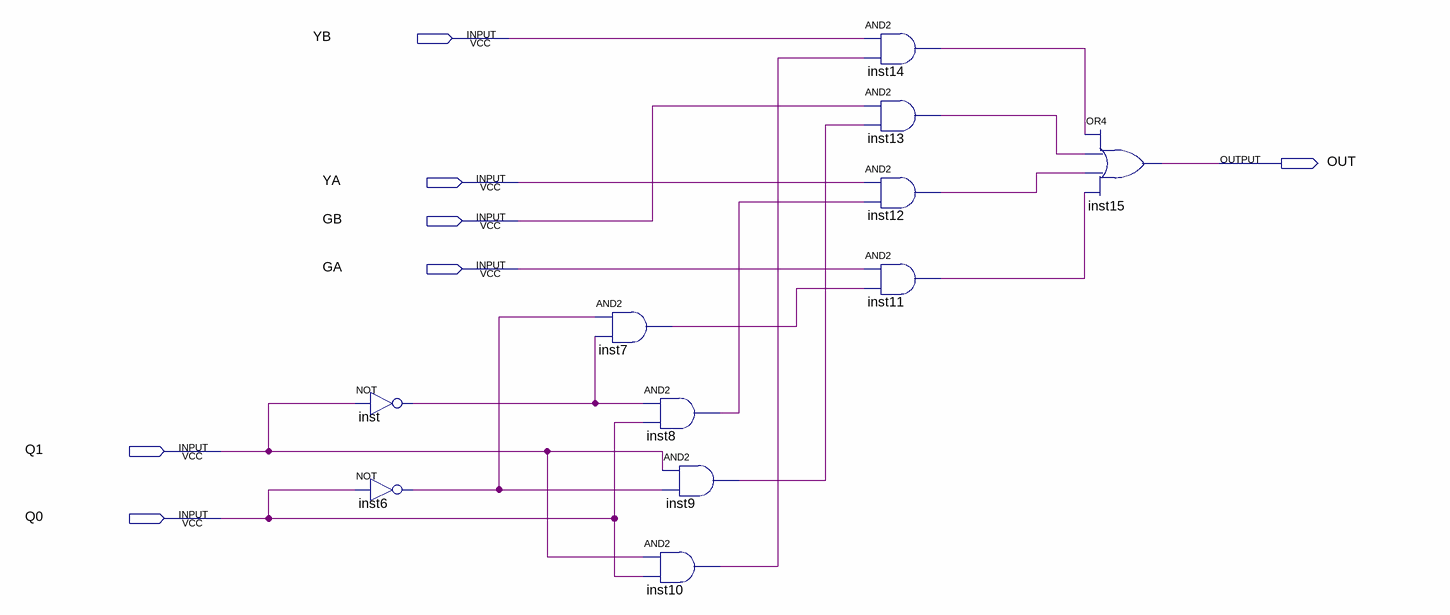
[diagram p0: schematic sheet]
// Quartus schematic chosesGY.bdf as structural Verilog: 11 symbols, 7 pins
module chosesGY (
  input  YB,
  input  YA,
  input  GB,
  input  GA,
  input  Q1,
  input  Q0,
  output OUT
);

  wire inst6_out, inst7_out, inst8_out, inst9_out, inst10_out, inst11_out, inst12_out, inst13_out,
       inst14_out, inst_out;

  not inst (inst_out, Q1);
  not inst6 (inst6_out, Q0);
  and inst7 (inst7_out, inst6_out, inst_out);
  and inst8 (inst8_out, inst_out, Q0);
  and inst9 (inst9_out, Q1, inst6_out);
  and inst10 (inst10_out, Q1, Q0);
  and inst14 (inst14_out, YB, inst10_out);
  and inst13 (inst13_out, GB, inst9_out);
  and inst12 (inst12_out, YA, inst8_out);
  and inst11 (inst11_out, GA, inst7_out);
  or inst15 (OUT, inst14_out, inst13_out, inst12_out, inst11_out);
endmodule
